# EAGLE design dualHYD-PRESS (EAGLE 7.6.0)

## Sheet 1 of 4
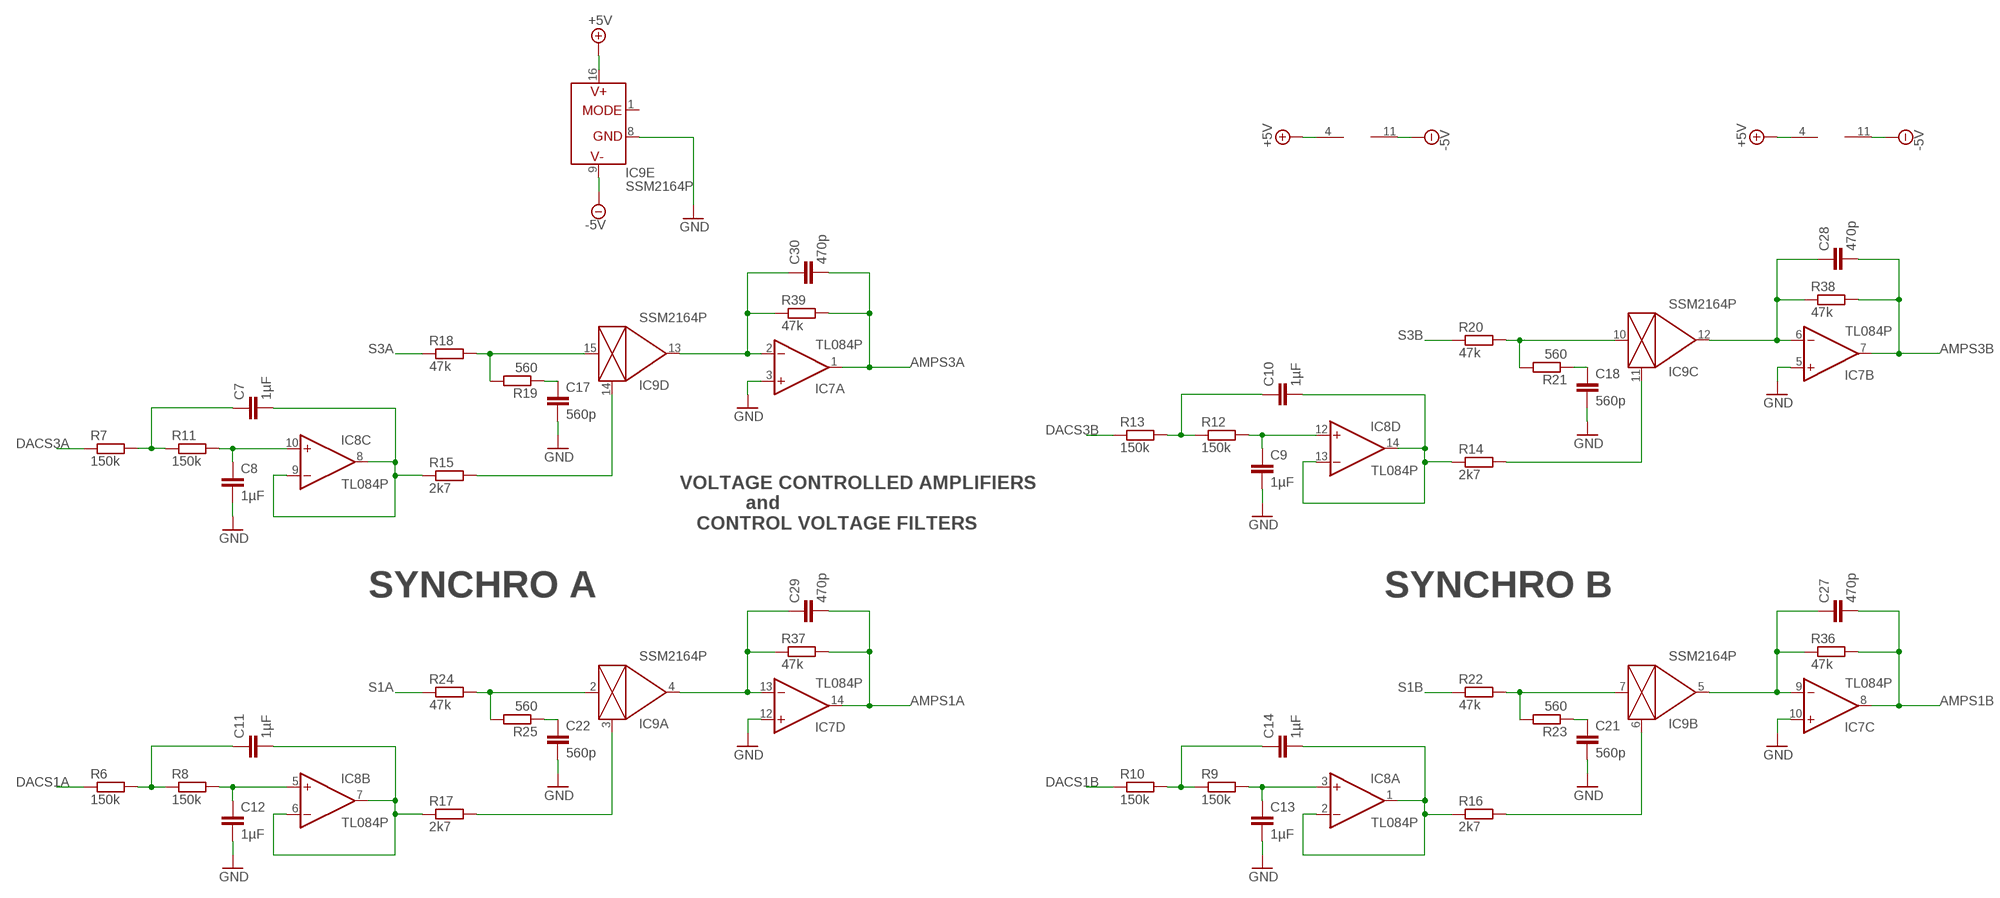
[diagram p0: schematic, sheet 1]

### Parts
C7  1µF  C-EU025-025X050  [C025-025X050]
C8  1µF  C-EU025-025X050  [C025-025X050]
C9  1µF  C-EU025-025X050  [C025-025X050]
C10  1µF  C-EU025-025X050  [C025-025X050]
C11  1µF  C-EU025-025X050  [C025-025X050]
C12  1µF  C-EU025-025X050  [C025-025X050]
C13  1µF  C-EU025-025X050  [C025-025X050]
C14  1µF  C-EU025-025X050  [C025-025X050]
C17  560p  C-EU025-025X050  [C025-025X050]
C18  560p  C-EU025-025X050  [C025-025X050]
C21  560p  C-EU025-025X050  [C025-025X050]
C22  560p  C-EU025-025X050  [C025-025X050]
C27  470p  C-EU025-025X050  [C025-025X050]
C28  470p  C-EU025-025X050  [C025-025X050]
C29  470p  C-EU025-025X050  [C025-025X050]
C30  470p  C-EU025-025X050  [C025-025X050]
IC7  TL084P  [DIL14]
IC8  TL084P  [DIL14]
IC9  SSM2164P  [DIL16]
R6  150k  R-EU_0207/7  [0207/7]
R7  150k  R-EU_0207/7  [0207/7]
R8  150k  R-EU_0207/7  [0207/7]
R9  150k  R-EU_0207/7  [0207/7]
R10  150k  R-EU_0207/7  [0207/7]
R11  150k  R-EU_0207/7  [0207/7]
R12  150k  R-EU_0207/7  [0207/7]
R13  150k  R-EU_0207/7  [0207/7]
R14  2k7  R-EU_0207/7  [0207/7]
R15  2k7  R-EU_0207/7  [0207/7]
R16  2k7  R-EU_0207/7  [0207/7]
R17  2k7  R-EU_0207/7  [0207/7]
R18  47k  R-EU_0207/7  [0207/7]
R19  560  R-EU_0207/7  [0207/7]
R20  47k  R-EU_0207/7  [0207/7]
R21  560  R-EU_0207/7  [0207/7]
R22  47k  R-EU_0207/7  [0207/7]
R23  560  R-EU_0207/7  [0207/7]
R24  47k  R-EU_0207/7  [0207/7]
R25  560  R-EU_0207/7  [0207/7]
R36  47k  R-EU_0207/7  [0207/7]
R37  47k  R-EU_0207/7  [0207/7]
R38  47k  R-EU_0207/7  [0207/7]
R39  47k  R-EU_0207/7  [0207/7]

### Nets
+5V [+5V]: IC7.4(P:V+) IC8.4(P:V+) IC9.16(E:V+) ; also sheet 2,4
-5V [-5V]: IC7.11(P:V-) IC8.11(P:V-) IC9.9(E:V-) ; also sheet 2,4
AMPS1A: C29.2 IC7.14(D:OUT) R37.2 ; also sheet 3
AMPS1B: C27.2 IC7.8(C:OUT) R36.2 ; also sheet 3
AMPS3A: C30.2 IC7.1(A:OUT) R39.2 ; also sheet 3
AMPS3B: C28.2 IC7.7(B:OUT) R38.2 ; also sheet 3
BXCF: C10.2 IC8.13(D:-IN) IC8.14(D:OUT) R14.1
BZCF: C11.2 IC8.6(B:-IN) IC8.7(B:OUT) R17.1
DACS1A: R6.1 ; also sheet 2
DACS1B: R10.1 ; also sheet 2
DACS3A: R7.1 ; also sheet 2
DACS3B: R13.1 ; also sheet 2
GND [ground]: C8.2 C9.2 C12.2 C13.2 C17.2 C18.2 C21.2 C22.2 IC7.3(A:+IN) IC7.5(B:+IN) IC7.10(C:+IN) IC7.12(D:+IN) IC9.8(E:GND) ; also sheet 2,3,4
M1XCF: C14.2 IC8.1(A:OUT) IC8.2(A:-IN) R16.1
M1YCF: C7.2 IC8.8(C:OUT) IC8.9(C:-IN) R15.1
N$3: C14.1 R9.1 R10.2
N$4: IC9.3(A:CTRL) R17.2
N$5: C13.1 IC8.3(A:+IN) R9.2
N$7: C11.1 R6.2 R8.1
N$8: IC9.14(D:CTRL) R15.2
N$9: C12.1 IC8.5(B:+IN) R8.2
N$11: C8.1 IC8.10(C:+IN) R11.2
N$13: C7.1 R7.2 R11.1
N$17: C10.1 R12.1 R13.2
N$18: C9.1 IC8.12(D:+IN) R12.2
N$28: IC9.11(C:CTRL) R14.2
N$32: IC9.6(B:CTRL) R16.2
N$49: IC9.10(C:IN) R20.2 R21.2
N$50: C18.1 R21.1
N$51: IC9.15(D:IN) R18.2 R19.2
N$52: C17.1 R19.1
N$53: IC9.7(B:IN) R22.2 R23.2
N$54: C21.1 R23.1
N$55: IC9.2(A:IN) R24.2 R25.2
N$56: C22.1 R25.1
N$57: C29.1 IC7.13(D:-IN) IC9.4(A:OUT) R37.1
N$59: C30.1 IC7.2(A:-IN) IC9.13(D:OUT) R39.1
N$62: C28.1 IC7.6(B:-IN) IC9.12(C:OUT) R38.1
N$63: C27.1 IC7.9(C:-IN) IC9.5(B:OUT) R36.1
S1A: R24.1 ; also sheet 4
S1B: R22.1 ; also sheet 4
S3A: R18.1 ; also sheet 4
S3B: R20.1 ; also sheet 4
Unconnected: IC9.1(E:MODE)

### Notes on the sheet
- VOLTAGE CONTROLLED AMPLIFIERS
              and
     CONTROL VOLTAGE FILTERS
- SYNCHRO A | SYNCHRO B

## Sheet 2 of 4
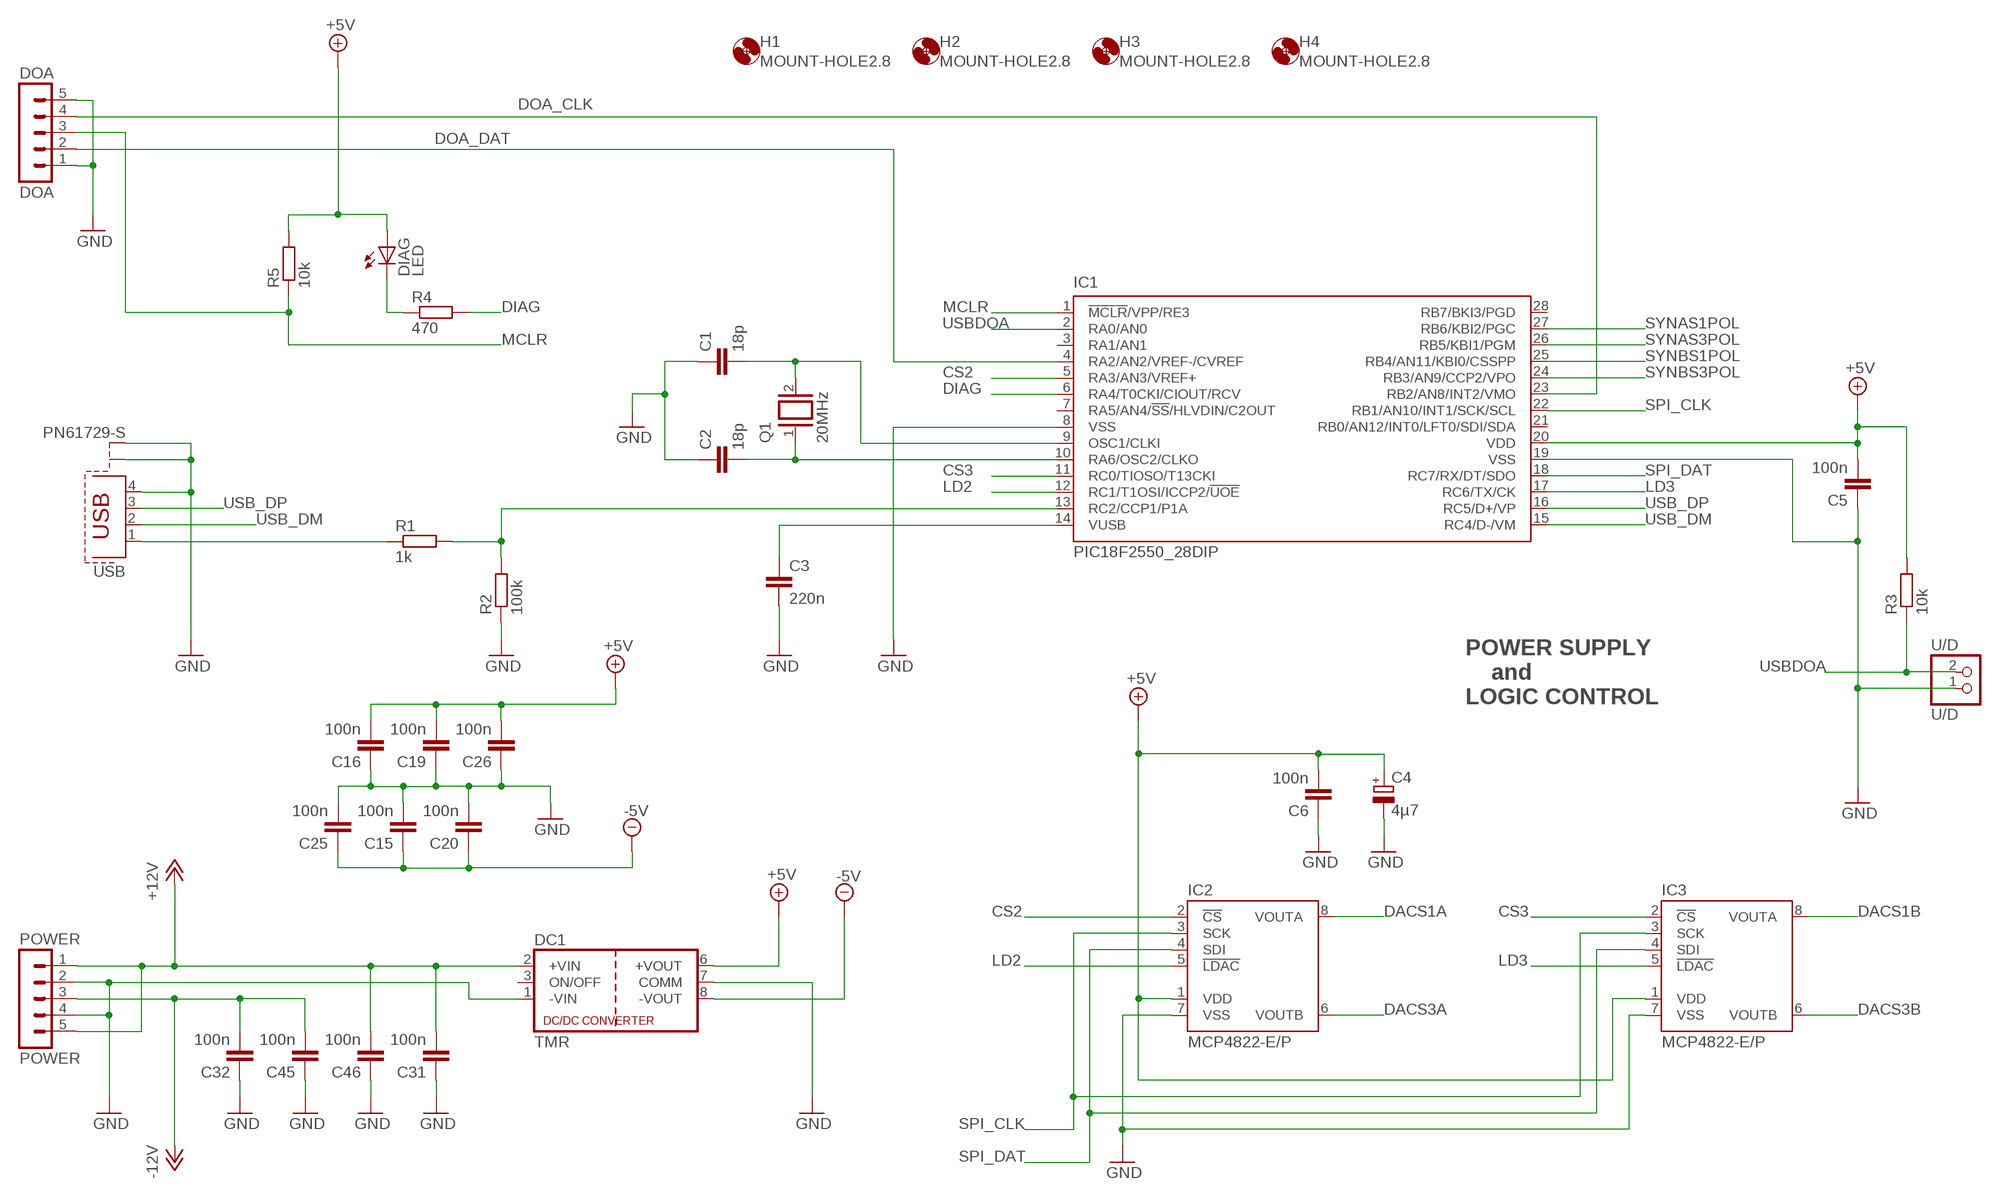
[diagram p1: schematic, sheet 2]

### Parts
C1  18p  C-EU025-025X050  [C025-025X050]
C2  18p  C-EU025-025X050  [C025-025X050]
C3  220n  C5/3  [C5B3]
C4  4µ7  CPOL-EUE2.5-5  [E2,5-5]
C5  100n  C-EU025-025X050  [C025-025X050]
C6  100n  C-EU025-025X050  [C025-025X050]
C15  100n  C-EU025-025X050  [C025-025X050]
C16  100n  C-EU025-025X050  [C025-025X050]
C19  100n  C-EU025-025X050  [C025-025X050]
C20  100n  C-EU025-025X050  [C025-025X050]
C25  100n  C-EU025-025X050  [C025-025X050]
C26  100n  C-EU025-025X050  [C025-025X050]
C31  100n  C-EU025-025X050  [C025-025X050]
C32  100n  C-EU025-025X050  [C025-025X050]
C45  100n  C-EU025-025X050  [C025-025X050]
C46  100n  C-EU025-025X050  [C025-025X050]
DC1  TMR  [TRACO_SIP-8]
DIAG  LED  LED3MM  [LED3MM]
DOA  DOA  MA05-1  [MA05-1]
H1  MOUNT-HOLE2.8  [2,8]
H2  MOUNT-HOLE2.8  [2,8]
H3  MOUNT-HOLE2.8  [2,8]
H4  MOUNT-HOLE2.8  [2,8]
IC1  PIC18F2550_28DIP  [DIL28-3]
IC2  MCP4822-E/P  [DIL08]
IC3  MCP4822-E/P  [DIL08]
POWER  POWER  MA05-1  [MA05-1]
Q1  20MHz  XTAL/S  [QS]
R1  1k  R-EU_0204/7  [0204/7]
R2  100k  R-EU_0204/7  [0204/7]
R3  10k  R-EU_0204/7  [0204/7]
R4  470  R-EU_0204/7  [0204/7]
R5  10k  R-EU_0204/7  [0204/7]
U/D  U/D  PINHD-1X2  [1X02]
USB  PN61729-S  [PN61729-S]

### Nets
+5V [+5V]: C4.+ C5.2 C6.2 C16.2 C19.2 C26.2 DC1.6(+VOUT) DIAG.A IC1.20(VDD) IC2.1(VDD) IC3.1(VDD) R3.2 R5.2 ; also sheet 1,4
+12V [+12V]: C31.2 C46.2 DC1.2(+VIN) POWER.1 POWER.5 ; also sheet 3
-5V [-5V]: C15.1 C20.1 C25.1 DC1.8(-VOUT) ; also sheet 1,4
-12V [-12V]: C32.2 C45.2 POWER.3 ; also sheet 3
CS2: IC1.5(RA3/AN3/VREF+) IC2.2(!CS)
CS3: IC1.11(RC0/TIOSO/T13CKI) IC3.2(!CS)
DACS1A: IC2.8(VOUTA) ; also sheet 1
DACS1B: IC3.8(VOUTA) ; also sheet 1
DACS3A: IC2.6(VOUTB) ; also sheet 1
DACS3B: IC3.6(VOUTB) ; also sheet 1
DIAG: IC1.6(RA4/T0CKI/CIOUT/RCV) R4.2
DOA_CLK: DOA.4 IC1.23(RB2/AN8/INT2/VMO)
DOA_DAT: DOA.2 IC1.4(RA2/AN2/VREF-/CVREF)
GND [ground]: C1.1 C2.1 C3.2 C4.- C5.1 C6.1 C15.2 C16.1 C19.1 C20.2 C25.2 C26.1 C31.1 C32.1 C45.1 C46.1 DC1.1(-VIN) DC1.7(COMM) DOA.1 DOA.5 IC1.8(VSS) IC1.19(VSS) IC2.7(VSS) IC3.7(VSS) POWER.2 POWER.4 R2.1 U/D.1 USB.4 USB.S1 USB.S2 ; also sheet 1,3,4
LD2: IC1.12(RC1/T1OSI/ICCP2/!UOE) IC2.5(!LDAC)
LD3: IC1.17(RC6/TX/CK) IC3.5(!LDAC)
MCLR: DOA.3 IC1.1(!MCLR!/VPP/RE3) R5.1
N$58: R1.1 USB.1
N$60: IC1.13(RC2/CCP1/P1A) R1.2 R2.2
N$61: C2.2 IC1.10(RA6/OSC2/CLKO) Q1.1
N$84: C1.2 IC1.9(OSC1/CLKI) Q1.2
N$88: DIAG.K(C) R4.1
N$96: C3.1 IC1.14(VUSB)
SPI_CLK: IC1.22(RB1/AN10/INT1/SCK/SCL) IC2.3(SCK) IC3.3(SCK)
SPI_DAT: IC1.18(RC7/RX/DT/SDO) IC2.4(SDI) IC3.4(SDI)
SYNAS1POL: IC1.27(RB6/KBI2/PGC) ; also sheet 4
SYNAS3POL: IC1.26(RB5/KBI1/PGM) ; also sheet 4
SYNBS1POL: IC1.25(RB4/AN11/KBI0/CSSPP) ; also sheet 4
SYNBS3POL: IC1.24(RB3/AN9/CCP2/VPO) ; also sheet 4
USB_DM: IC1.15(RC4/D-/VM) USB.2
USB_DP: IC1.16(RC5/D+/VP) USB.3
USBDOA: IC1.2(RA0/AN0) R3.1 U/D.2
Unconnected: DC1.3(ON/OFF) IC1.3(RA1/AN1) IC1.7(RA5/AN4/!SS!/HLVDIN/C2OUT) IC1.21(RB0/AN12/INT0/LFT0/SDI/SDA) IC1.28(RB7/BKI3/PGD)

### Notes on the sheet
- POWER SUPPLY
      and
  LOGIC CONTROL

## Sheet 3 of 4
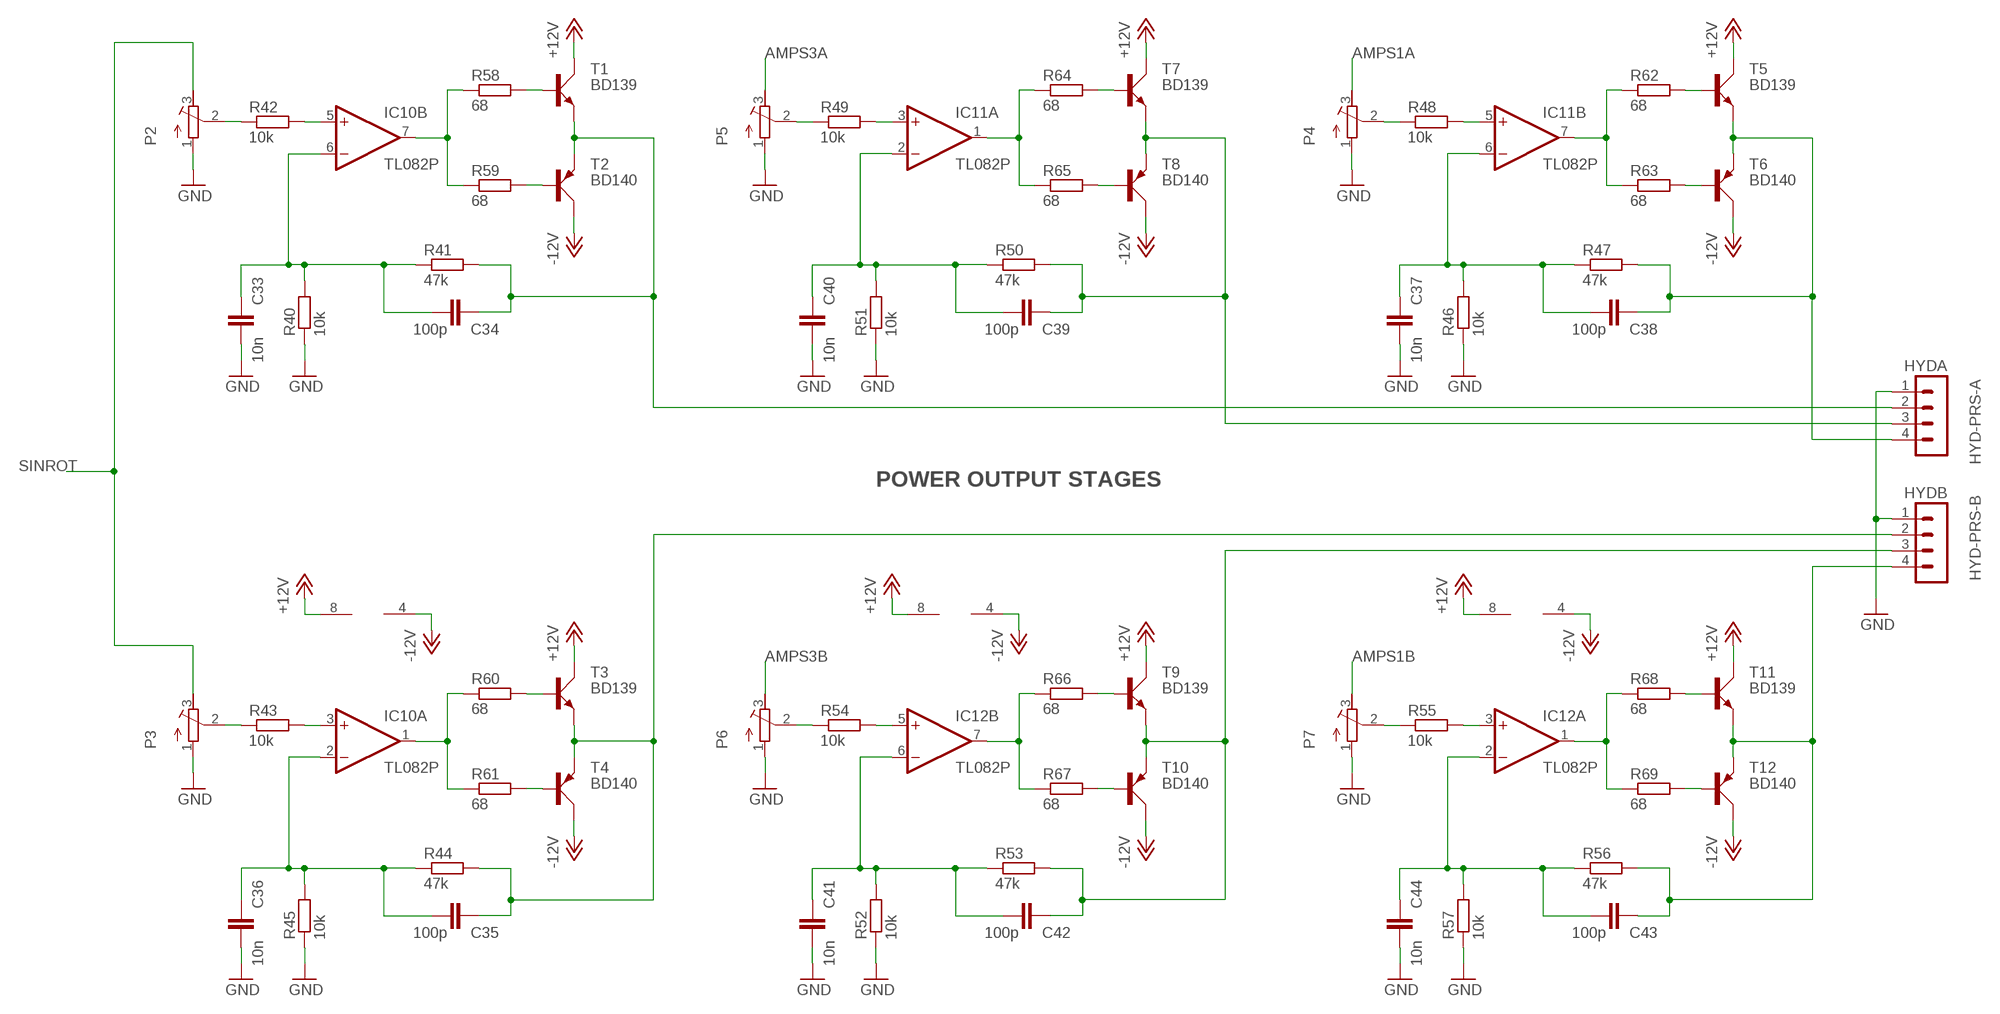
[diagram p2: schematic, sheet 3]

### Parts
C33  10n  C-EU025-025X050  [C025-025X050]
C34  100p  C-EU025-025X050  [C025-025X050]
C35  100p  C-EU025-025X050  [C025-025X050]
C36  10n  C-EU025-025X050  [C025-025X050]
C37  10n  C-EU025-025X050  [C025-025X050]
C38  100p  C-EU025-025X050  [C025-025X050]
C39  100p  C-EU025-025X050  [C025-025X050]
C40  10n  C-EU025-025X050  [C025-025X050]
C41  10n  C-EU025-025X050  [C025-025X050]
C42  100p  C-EU025-025X050  [C025-025X050]
C43  100p  C-EU025-025X050  [C025-025X050]
C44  10n  C-EU025-025X050  [C025-025X050]
HYD-PRS-A  HYDA  MA04-1  [MA04-1]
HYD-PRS-B  HYDB  MA04-1  [MA04-1]
IC10  TL082P  [DIL08]
IC11  TL082P  [DIL08]
IC12  TL082P  [DIL08]
P2  R-TRIMM64Y  [RTRIM64Y]
P3  R-TRIMM64Y  [RTRIM64Y]
P4  R-TRIMM64Y  [RTRIM64Y]
P5  R-TRIMM64Y  [RTRIM64Y]
P6  R-TRIMM64Y  [RTRIM64Y]
P7  R-TRIMM64Y  [RTRIM64Y]
R40  10k  R-EU_0204/7  [0204/7]
R41  47k  R-EU_0204/7  [0204/7]
R42  10k  R-EU_0204/7  [0204/7]
R43  10k  R-EU_0204/7  [0204/7]
R44  47k  R-EU_0204/7  [0204/7]
R45  10k  R-EU_0204/7  [0204/7]
R46  10k  R-EU_0204/7  [0204/7]
R47  47k  R-EU_0204/7  [0204/7]
R48  10k  R-EU_0204/7  [0204/7]
R49  10k  R-EU_0204/7  [0204/7]
R50  47k  R-EU_0204/7  [0204/7]
R51  10k  R-EU_0204/7  [0204/7]
R52  10k  R-EU_0204/7  [0204/7]
R53  47k  R-EU_0204/7  [0204/7]
R54  10k  R-EU_0204/7  [0204/7]
R55  10k  R-EU_0204/7  [0204/7]
R56  47k  R-EU_0204/7  [0204/7]
R57  10k  R-EU_0204/7  [0204/7]
R58  68  R-EU_0204/7  [0204/7]
R59  68  R-EU_0204/7  [0204/7]
R60  68  R-EU_0204/7  [0204/7]
R61  68  R-EU_0204/7  [0204/7]
R62  68  R-EU_0204/7  [0204/7]
R63  68  R-EU_0204/7  [0204/7]
R64  68  R-EU_0204/7  [0204/7]
R65  68  R-EU_0204/7  [0204/7]
R66  68  R-EU_0204/7  [0204/7]
R67  68  R-EU_0204/7  [0204/7]
R68  68  R-EU_0204/7  [0204/7]
R69  68  R-EU_0204/7  [0204/7]
T1  BD139  [TO126AV]
T2  BD140  [TO126AV]
T3  BD139  [TO126AV]
T4  BD140  [TO126AV]
T5  BD139  [TO126AV]
T6  BD140  [TO126AV]
T7  BD139  [TO126AV]
T8  BD140  [TO126AV]
T9  BD139  [TO126AV]
T10  BD140  [TO126AV]
T11  BD139  [TO126AV]
T12  BD140  [TO126AV]

### Nets
+12V [+12V]: IC10.8(P:V+) IC11.8(P:V+) IC12.8(P:V+) T1.C T3.C T5.C T7.C T9.C T11.C ; also sheet 2
-12V [-12V]: IC10.4(P:V-) IC11.4(P:V-) IC12.4(P:V-) T2.C T4.C T6.C T8.C T10.C T12.C ; also sheet 2
AMPS1A: P4.3(E) ; also sheet 1
AMPS1B: P7.3(E) ; also sheet 1
AMPS3A: P5.3(E) ; also sheet 1
AMPS3B: P6.3(E) ; also sheet 1
GND [ground]: C33.1 C36.1 C37.1 C40.1 C41.1 C44.1 HYD-PRS-A.1 HYD-PRS-B.1 P2.1(A) P3.1(A) P4.1(A) P5.1(A) P6.1(A) P7.1(A) R40.1 R45.1 R46.1 R51.1 R52.1 R57.1 ; also sheet 1,2,4
N$12: R58.2 T1.B
N$16: P2.2(S) R42.1
N$20: R59.2 T2.B
N$23: IC10.5(B:+IN) R42.2
N$24: R60.2 T3.B
N$25: R61.2 T4.B
N$26: P6.2(S) R54.1
N$27: R62.2 T5.B
N$29: R63.2 T6.B
N$30 [SYN]: C38.2 HYD-PRS-A.4 R47.2 T5.E T6.E
N$31 [SYN]: C42.2 HYD-PRS-B.3 R53.2 T9.E T10.E
N$33: R67.2 T10.B
N$34: R66.2 T9.B
N$36: R64.2 T7.B
N$37: R65.2 T8.B
N$38 [SYN]: C35.2 HYD-PRS-B.2 R44.2 T3.E T4.E
N$39: R68.2 T11.B
N$40: R69.2 T12.B
N$41: IC10.3(A:+IN) R43.2
N$42 [SYN]: C43.2 HYD-PRS-B.4 R56.2 T11.E T12.E
N$43: IC12.7(B:OUT) R66.1 R67.1
N$44: IC12.1(A:OUT) R68.1 R69.1
N$45: IC11.7(B:OUT) R62.1 R63.1
N$46: P3.2(S) R43.1
N$47: IC11.1(A:OUT) R64.1 R65.1
N$48: IC10.7(B:OUT) R58.1 R59.1
N$64: P5.2(S) R49.1
N$65: IC11.3(A:+IN) R49.2
N$66: P4.2(S) R48.1
N$67: IC11.5(B:+IN) R48.2
N$68: IC10.1(A:OUT) R60.1 R61.1
N$69: IC12.5(B:+IN) R54.2
N$70: C33.2 C34.1 IC10.6(B:-IN) R40.2 R41.1
N$71: P7.2(S) R55.1
N$72: C35.1 C36.2 IC10.2(A:-IN) R44.1 R45.2
N$73: C37.2 C38.1 IC11.6(B:-IN) R46.2 R47.1
N$74: IC12.3(A:+IN) R55.2
N$75: C39.1 C40.2 IC11.2(A:-IN) R50.1 R51.2
N$77: C41.2 C42.1 IC12.6(B:-IN) R52.2 R53.1
N$79: C43.1 C44.2 IC12.2(A:-IN) R56.1 R57.2
N$99 [SYN]: C39.2 HYD-PRS-A.3 R50.2 T7.E T8.E
N$106 [SYN]: C34.2 HYD-PRS-A.2 R41.2 T1.E T2.E
SINROT: P2.3(E) P3.3(E) ; also sheet 4

### Notes on the sheet
- POWER OUTPUT STAGES

## Sheet 4 of 4
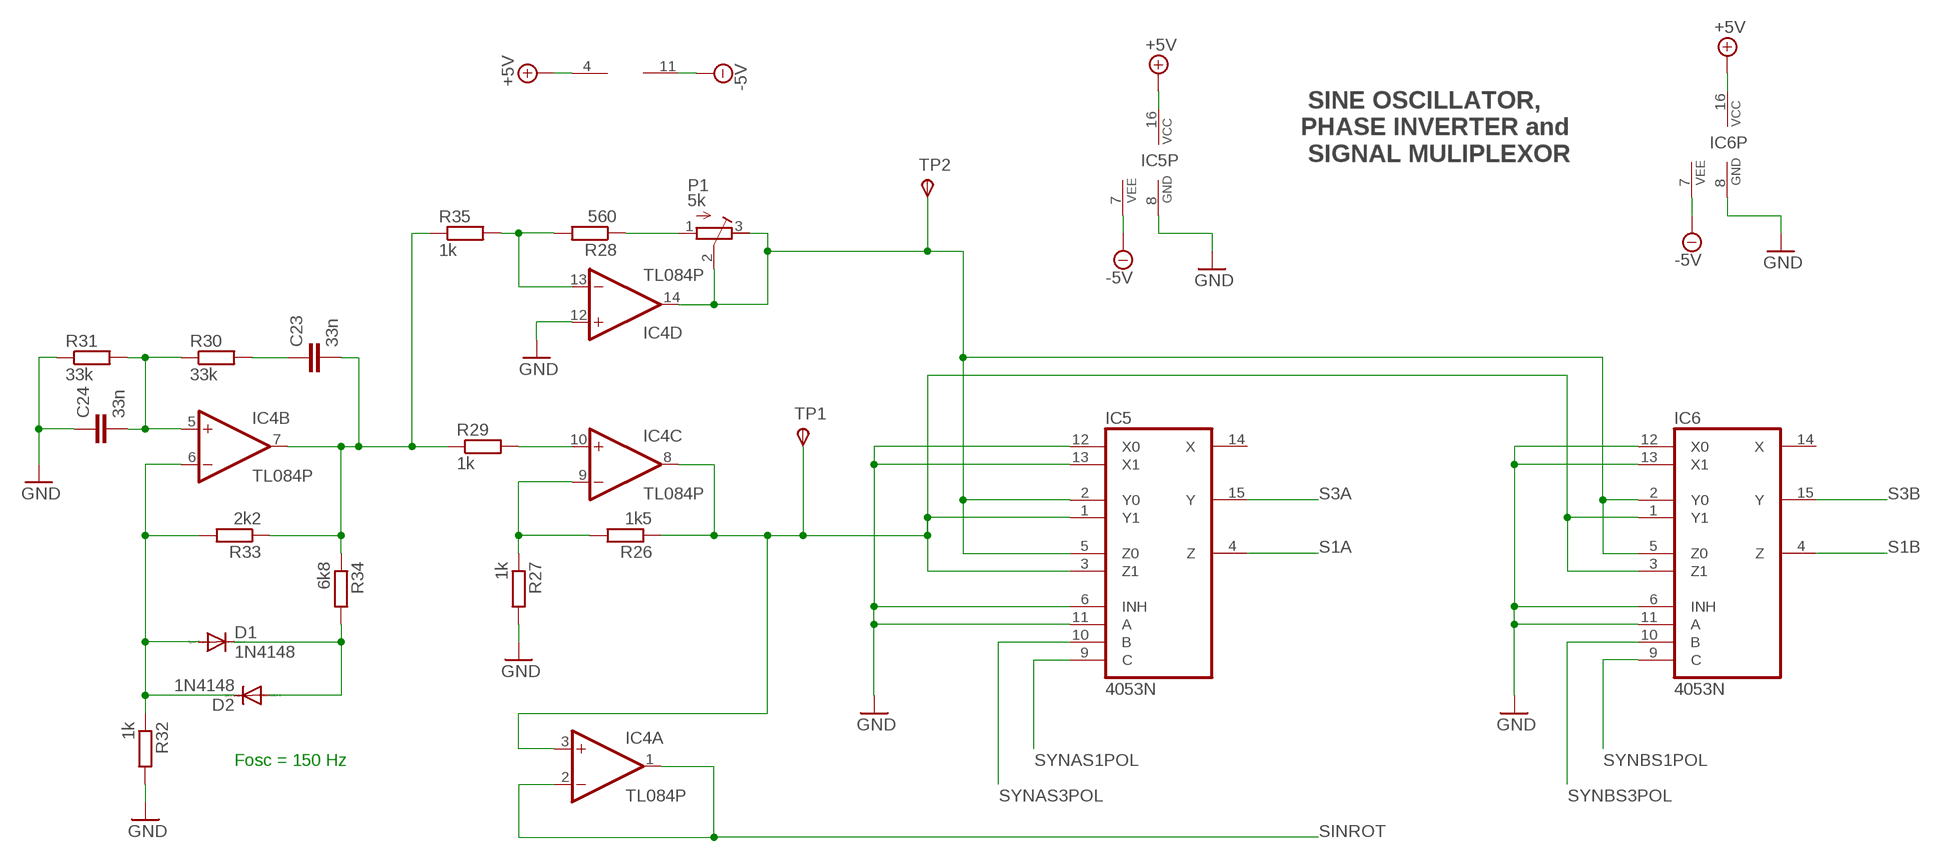
[diagram p3: schematic, sheet 4]

### Parts
C23  33n  C-EU025-024X044  [C025-024X044]
C24  33n  C-EU025-024X044  [C025-024X044]
D1  1N4148  1N4148DO35-7  [DO35-7]
D2  1N4148  1N4148DO35-7  [DO35-7]
IC4  TL084P  [DIL14]
IC5  4053N  [DIL16]
IC6  4053N  [DIL16]
P1  5k  R-TRIMM64Y  [RTRIM64Y]
R26  1k5  R-EU_0204/7  [0204/7]
R27  1k  R-EU_0204/7  [0204/7]
R28  560  R-EU_0204/7  [0204/7]
R29  1k  R-EU_0204/7  [0204/7]
R30  33k  R-EU_0204/7  [0204/7]
R31  33k  R-EU_0204/7  [0204/7]
R32  1k  R-EU_0204/7  [0204/7]
R33  2k2  R-EU_0204/7  [0204/7]
R34  6k8  R-EU_0204/7  [0204/7]
R35  1k  R-EU_0204/7  [0204/7]
TP1  TPSPAD1-17  [P1-17]
TP2  TPSPAD1-17  [P1-17]

### Nets
+5V [+5V]: IC4.4(P:V+) IC5.16(VCC) IC6.16(VCC) ; also sheet 1,2
-5V [-5V]: IC4.11(P:V-) IC5.7(VEE) IC6.7(VEE) ; also sheet 1,2
GND [ground]: C24.1 IC4.12(D:+IN) IC5.6(INH) IC5.8(GND) IC5.11(A) IC5.12(X0) IC5.13(X1) IC6.6(INH) IC6.8(GND) IC6.11(A) IC6.12(X0) IC6.13(X1) R27.2 R31.1 R32.2 ; also sheet 1,2,3
N$1: D1.A D2.C IC4.6(B:-IN) R32.1 R33.2
N$2: D1.C D2.A R34.2
N$6: IC4.9(C:-IN) R26.2 R27.1
N$10: IC4.13(D:-IN) R28.2 R35.2
N$14: IC4.10(C:+IN) R29.2
N$15: IC4.3(A:+IN) IC4.8(C:OUT) IC5.1(Y1) IC5.3(Z1) IC6.1(Y1) IC6.3(Z1) R26.1 TP1.TP(PP)
N$19: C23.2 IC4.7(B:OUT) R29.1 R33.1 R34.1 R35.1
N$21: P1.1(A) R28.1
N$22: C23.1 R30.2
N$35: IC4.14(D:OUT) IC5.2(Y0) IC5.5(Z0) IC6.2(Y0) IC6.5(Z0) P1.2(S) P1.3(E) TP2.TP(PP)
N$85: C24.2 IC4.5(B:+IN) R30.1 R31.2
S1A: IC5.4(Z) ; also sheet 1
S1B: IC6.4(Z) ; also sheet 1
S3A: IC5.15(Y) ; also sheet 1
S3B: IC6.15(Y) ; also sheet 1
SINROT: IC4.1(A:OUT) IC4.2(A:-IN) ; also sheet 3
SYNAS1POL: IC5.9(C) ; also sheet 2
SYNAS3POL: IC5.10(B) ; also sheet 2
SYNBS1POL: IC6.9(C) ; also sheet 2
SYNBS3POL: IC6.10(B) ; also sheet 2
Unconnected: IC5.14(X) IC6.14(X)

### Notes on the sheet
- SINE OSCILLATOR,
  PHASE INVERTER and
   SIGNAL MULIPLEXOR
- Fosc = 150 Hz

## Library data of the parts
C1 C2 C5-C46 = rcl:C-EU: CAPACITOR, European symbol
C3 = capacitor-wima:C: CAPACITOR naming: grid - package width
C4 = rcl:CPOL-EU: POLARIZED CAPACITOR, European symbol
D1 D2 = diode:1N4148: DIODE high speed (Philips)
DC1 = traco-tmr-dual:TMR
DIAG = henk:LED: LEDs Standard schematic elements and footprints for 5mm, 3mm, 1206, and 0603 sized LEDs. 5mm - Spark Fun Electronics SKU : COM-00529 (and others)
DOA POWER = con-lstb:MA05-1: PIN HEADER; OC_FARNELL: unknown; OC_NEWARK: unknown
H1-H4 = holes:MOUNT-HOLE: MOUNTING HOLE with drill center marker
HYD-PRS-A HYD-PRS-B = con-lstb:MA04-1: PIN HEADER; OC_FARNELL: unknown; OC_NEWARK: unknown
IC1 = microchip:PIC18F2*_28: USB Microcontrollers with nanoWatt Technology High-Performance, Enhanced Flash, 28/40/44-Pin, Source: http://ww1.microchip.com/downloads/en/devicedoc/39632c.pdf; MF: MICROCHIP; MPN: PIC18F2550-I/SP; OC_FARNELL: 1523822; OC_NEWARK: 80K6054
IC2 IC3 = nh-ic:MCP4822: Microchip MCP4822 According to datasheet http://ww1.microchip.com/downloads/en/DeviceDoc/22249A.pdf. Created by Nils Hintze <n.hintze@elektronikpage.net>
IC4 IC7 IC8 = linear:TL084: OP AMP
IC5 IC6 = 40xx:4053: Triple 2-channel ANALOG MULTIPLEXER
IC9 = ssm2164:SSM2164
IC10-IC12 = linear:TL082: OP AMP Data sheet <http://www.ti.com/lit/ds/symlink/tl084a . pdf>; DATA_SHEET: <a href="http://www.ti.com/lit/ds/symlink/tl084a.pdf"> Data sheet </a>
P1-P7 = rcl:R-TRIMM: Trimm resistor
Q1 = special:XTAL/S: CRYSTAL
R1-R69 = rcl:R-EU_: RESISTOR, European symbol
T1 T3 T5 T7 T9 T11 = transistor-power:BD139: NPN TRANSISTOR
T2 T4 T6 T8 T10 T12 = transistor-power:BD140: PNP TRANSISTOR
TP1 TP2 = testpad:TPS: TEST PIN
U/D = pinhead:PINHD-1X2: PIN HEADER
USB = con-berg:PN61729-S: BERG USB connector; OC_FARNELL: unknown; OC_NEWARK: unknown

## Net classes
0 default: width 0.254 mm, drill 0.254 mm, clearance 0.254 mm
1 ground: width 0.508 mm, drill 0.254 mm, clearance 0.254 mm
2 +5V: width 0.381 mm, drill 0.254 mm, clearance 0.254 mm
3 -5V: width 0.381 mm, drill 0.254 mm, clearance 0.254 mm
4 +12V: width 0.381 mm, drill 0.254 mm, clearance 0.254 mm
5 -12V: width 0.381 mm, drill 0.254 mm, clearance 0.254 mm
6 SYN: width 0.381 mm, drill 0.381 mm, clearance 0.508 mm
7 HIV2: width 0.381 mm, drill 0.381 mm, clearance 0.508 mm

## Board
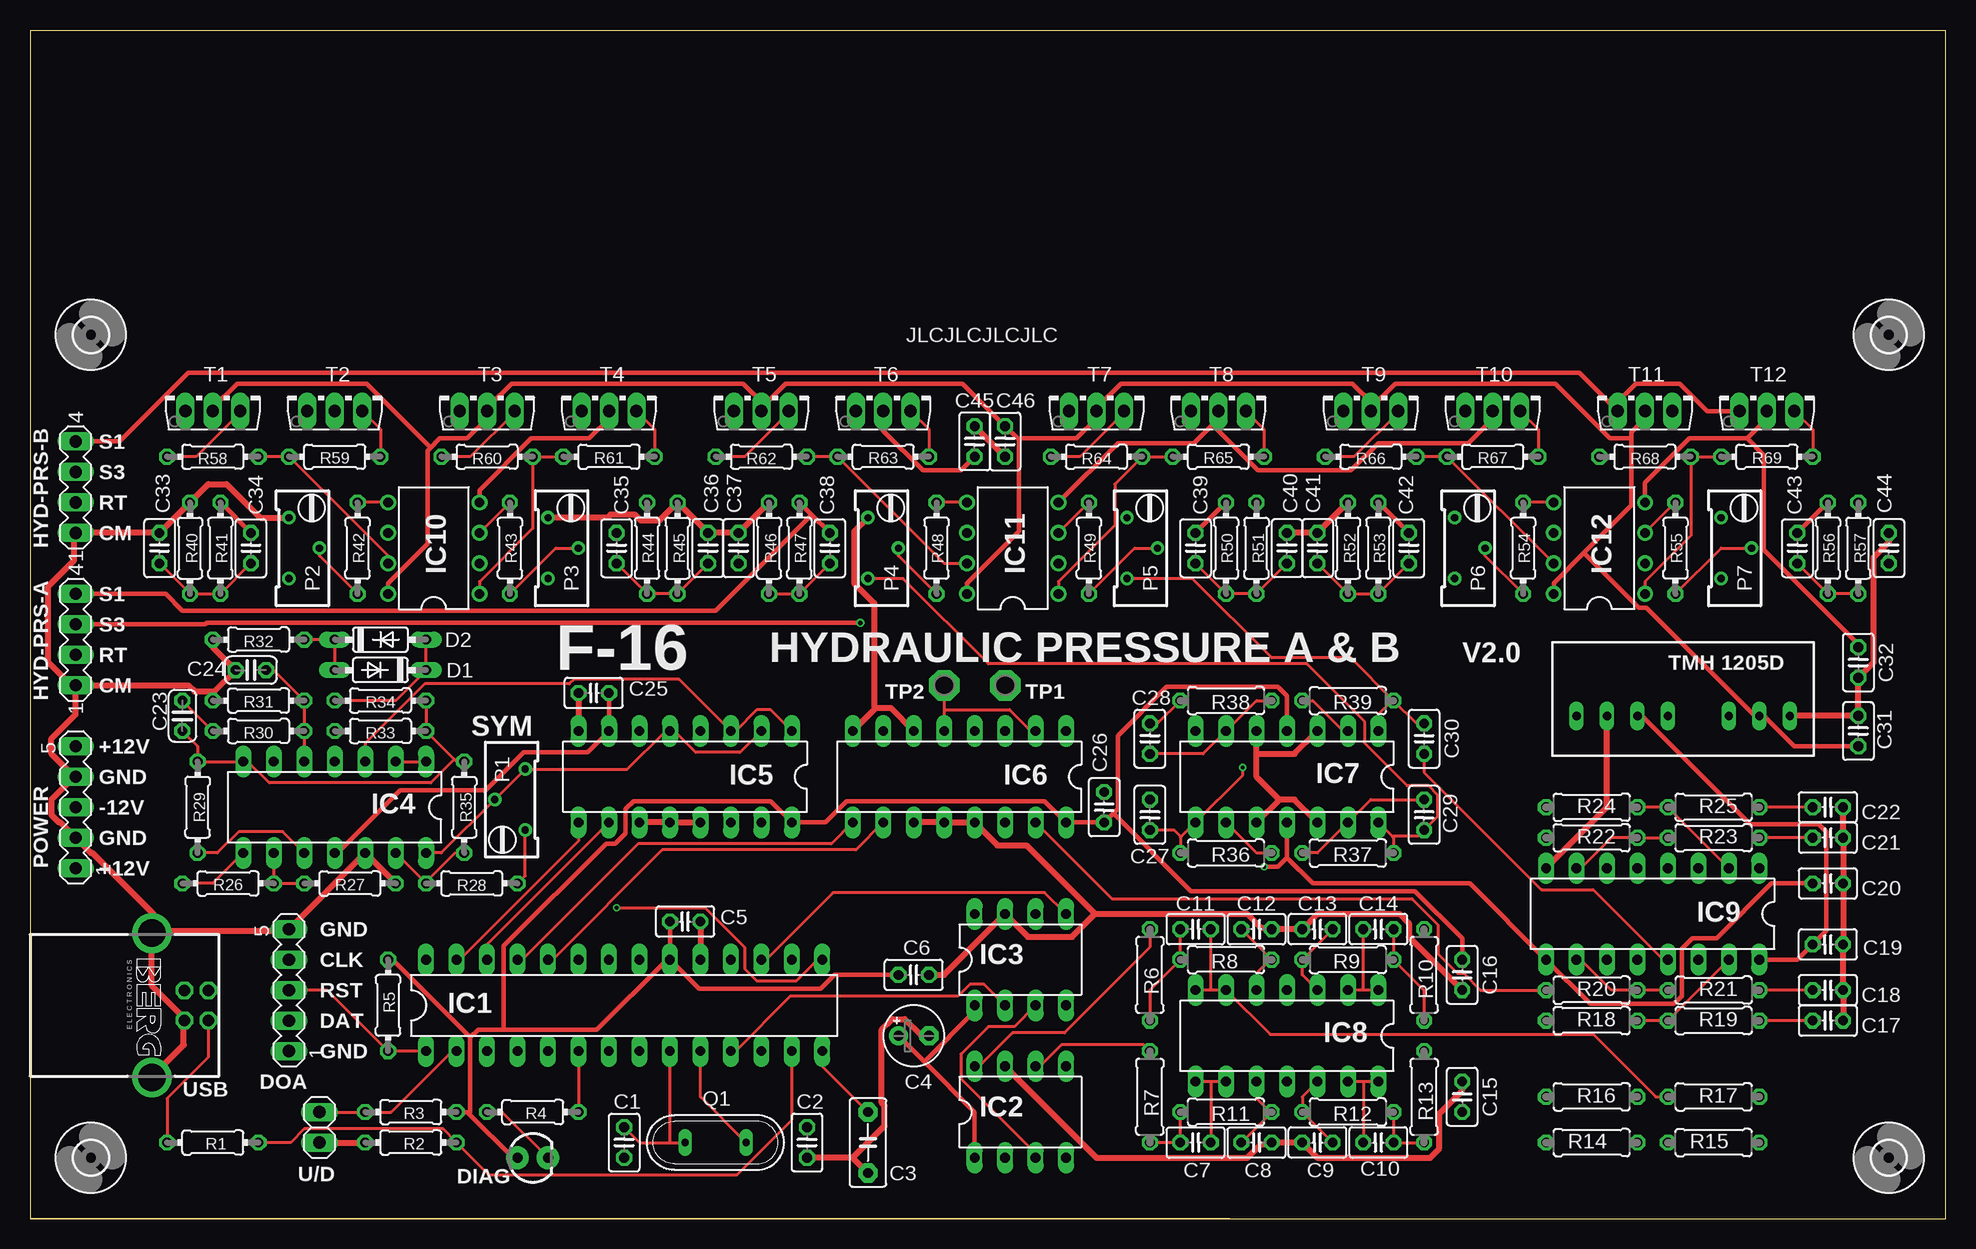
[diagram p4: board, top side]
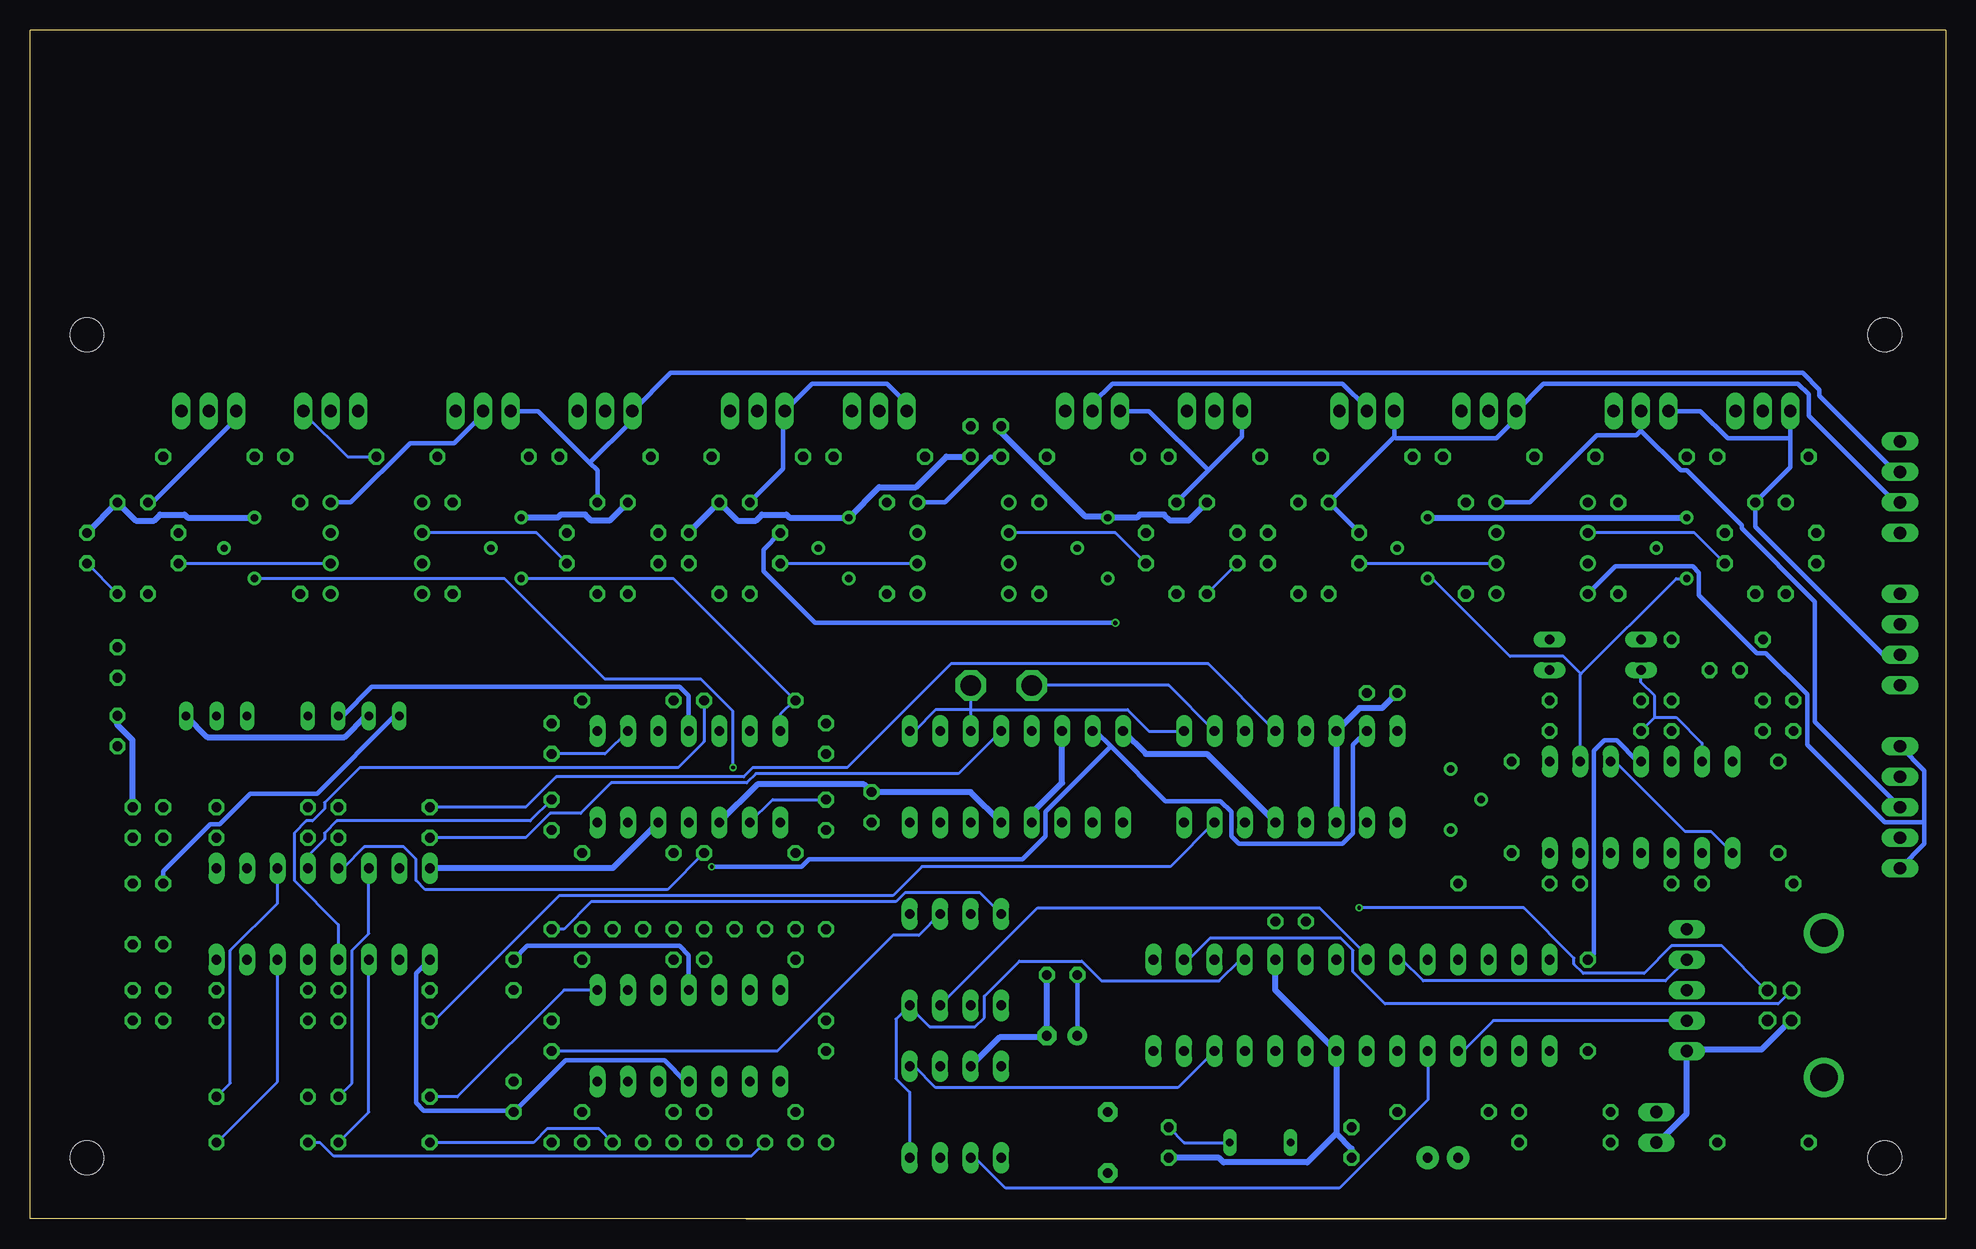
[diagram p5: board, bottom side, seen from below]

Size 159.69 x 99.07 mm. Coordinates in mm from the lower left corner, seen from the top.
Outline: 159.69,99.06 159.69,0.01 0,0.01 0,99.06
Outline: 100,0 0,0
Outline: 0,99.07 159.69,99.07
Copper layers (1*16): Top 0.035mm / dielectric 1.5mm / Bottom 0.035mm
Design rules "ITEADstudio_DRC": minimum track width 6mil, minimum drill 12mil, track to track 6mil, track to pad 6mil, pad to pad 6mil, via to via 6mil, smd to smd 0mil, copper to edge 10mil, drill to drill 10mil, minimum pad ring 10mil, minimum via ring 6mil, stop-mask expansion 2mil, vias tented up to drill 100mil, thermal gap 10mil

### Footprints (pad centres in the part's own frame; a part is rotated, then mirrored left to right if it is on the bottom)
C025-025X050 = drill 0.813 octagon: 1 -1.27,0; 2 1.27,0
C5B3 = drill 0.813 pad 1.6 octagon: 1 -2.54,0; 2 2.54,0
E2,5-5 = drill 0.813 pad 1.6: + -1.27,0 | drill 0.813 pad 1.6 octagon: - 1.27,0
C025-024X044 = drill 0.813 octagon: 1 -1.27,0; 2 1.27,0
DO35-7 = drill 0.813 long: A 3.81,0; C -3.81,0
TRACO_SIP-8 = drill 0.7 long: 1 -8.89,0; 2 -6.35,0; 3 -3.81,0; 5 1.27,0; 6 3.81,0; 7 6.35,0; 8 8.89,0
LED3MM = drill 0.813 pad 1.88: A -1.27,0; K 1.27,0
MA05-1 = drill 1.016 long: 1 -5.08,0; 2 -2.54,0; 3 0,0; 4 2.54,0; 5 5.08,0
2,8 = hole 2.8: 0,0
MA04-1 = drill 1.016 long: 1 -3.81,0; 2 -1.27,0; 3 1.27,0; 4 3.81,0
DIL28-3 = drill 0.813 long: 1 -16.51,-3.81; 2 -13.97,-3.81; 3 -11.43,-3.81; 4 -8.89,-3.81; 5 -6.35,-3.81; 6 -3.81,-3.81; 7 -1.27,-3.81; 8 1.27,-3.81; 9 3.81,-3.81; 10 6.35,-3.81; 11 8.89,-3.81; 12 11.43,-3.81; 13 13.97,-3.81; 14 16.51,-3.81; 15 16.51,3.81; 16 13.97,3.81; 17 11.43,3.81; 18 8.89,3.81; 19 6.35,3.81; 20 3.81,3.81; 21 1.27,3.81; 22 -1.27,3.81; 23 -3.81,3.81; 24 -6.35,3.81; 25 -8.89,3.81; 26 -11.43,3.81; 27 -13.97,3.81; 28 -16.51,3.81
DIL08 = drill 0.813 long: 1 -3.81,-3.81; 2 -1.27,-3.81; 3 1.27,-3.81; 4 3.81,-3.81; 5 3.81,3.81; 6 1.27,3.81; 7 -1.27,3.81; 8 -3.81,3.81
DIL14 = drill 0.813 long: 1 -7.62,-3.81; 2 -5.08,-3.81; 3 -2.54,-3.81; 4 0,-3.81; 5 2.54,-3.81; 6 5.08,-3.81; 7 7.62,-3.81; 8 7.62,3.81; 9 5.08,3.81; 10 2.54,3.81; 11 0,3.81; 12 -2.54,3.81; 13 -5.08,3.81; 14 -7.62,3.81
DIL16 = drill 0.813 long: 1 -8.89,-3.81; 2 -6.35,-3.81; 3 -3.81,-3.81; 4 -1.27,-3.81; 5 1.27,-3.81; 6 3.81,-3.81; 7 6.35,-3.81; 8 8.89,-3.81; 9 8.89,3.81; 10 6.35,3.81; 11 3.81,3.81; 12 1.27,3.81; 13 -1.27,3.81; 14 -3.81,3.81; 15 -6.35,3.81; 16 -8.89,3.81
DIL08' = drill 0.813 pad 1.27: 1 -3.81,-3.81; 2 -1.27,-3.81; 3 1.27,-3.81; 4 3.81,-3.81; 5 3.81,3.81; 6 1.27,3.81; 7 -1.27,3.81; 8 -3.81,3.81
RTRIM64Y = drill 0.61: 1 0,-2.54; 2 -2.54,0; 3 0,2.54
QS = drill 0.61 long: 1 -2.54,0; 2 2.54,0
0204/7 = drill 0.813 octagon: 1 -3.81,0; 2 3.81,0
0207/7 = drill 0.813 octagon: 1 -3.81,0; 2 3.81,0
TO126AV = drill 1.016 long: B 2.286,-1.27; C 0,-1.27; E -2.286,-1.27
P1-17 = drill 1.702 pad 2.54 octagon: TP 0,0
1X02 = drill 1.016 long: 1 -1.27,0; 2 1.27,0
PN61729-S = drill 0.95 octagon: 1 1.25,4.71; 2 -1.25,4.71; 3 -1.25,2.71; 4 1.25,2.71 | drill 2.3 pad 2.9: S1 -6.02,0; S2 6.02,0

### Placement (x,y rotation side)
C1  49.53,6.36 90 top
C2  64.77,6.36 90 top
C3  69.85,6.36 270 top
C4  73.66,15.25 0 top
C5  54.61,24.78 180 top
C6  73.66,20.33 180 top
C7  97.16,6.36 0 top
C8  102.23,6.36 0 top
C9  107.31,6.36 180 top
C10  112.39,6.36 180 top
C11  97.16,24.14 0 top
C12  102.23,24.14 0 top
C13  107.31,24.14 180 top
C14  112.39,24.14 180 top
C15  119.38,10.17 90 top
C16  119.38,20.33 90 top
C17  149.86,16.52 0 top
C18  149.86,19.06 0 top
C19  149.86,22.87 180 top
C20  149.86,27.95 0 top
C21  149.86,31.76 0 top
C22  149.86,34.3 0 top
C23  12.7,41.92 270 top
C24  18.41,45.73 0 top
C25  46.99,43.82 180 top
C26  89.53,34.3 270 top
C27  93.34,33.66 270 top
C28  93.34,40.02 90 top
C29  116.2,33.66 270 top
C30  116.2,40.02 90 top
C31  152.4,40.65 270 top
C32  152.4,46.36 90 top
C33  10.79,55.89 270 top
C34  18.41,55.89 90 top
C35  48.9,55.89 90 top
C36  56.52,55.89 270 top
C37  59.05,55.89 270 top
C38  66.67,55.89 90 top
C39  97.16,55.89 90 top
C40  104.78,55.89 270 top
C41  107.31,55.89 270 top
C42  114.94,55.89 90 top
C43  147.32,55.89 90 top
C44  154.94,55.89 270 top
C45  78.74,64.78 270 top
C46  81.28,64.78 90 top
D1  29.21,45.73 180 top
D2  29.21,48.27 0 top
DC1  137.79,41.92 180 top
DIAG  41.91,5.09 0 top
DOA  21.59,19.06 90 top
H1  154.94,5.09 0 top
H2  5.08,5.09 0 top
H3  154.94,73.67 0 top
H4  5.08,73.67 0 top
HYD-PRS-A  3.81,48.27 90 top
HYD-PRS-B  3.81,60.97 90 top
IC1  49.53,17.79 0 top
IC2  82.55,8.9 0 top
IC3  82.55,21.6 0 top
IC4  25.4,34.3 180 top
IC5  54.61,36.84 180 top
IC6  77.47,36.84 180 top
IC7  104.78,36.84 180 top
IC8  104.78,15.25 180 top
IC9  135.25,25.41 180 top
IC10  TL082P  [DIL08']  33.66,55.89 90 top
IC11  TL082P  [DIL08']  81.92,55.89 90 top
IC12  TL082P  [DIL08']  130.81,55.89 90 top
P1  41.27,34.93 0 top
P2  21.59,55.89 180 top
P3  43.18,55.89 180 top
P4  69.85,55.89 180 top
P5  91.44,55.89 180 top
P6  118.75,55.89 180 top
P7  140.97,55.89 180 top
POWER  3.81,34.3 90 top
Q1  57.15,6.36 180 top
R1  15.24,6.36 0 top
R2  31.75,6.36 0 top
R3  31.75,8.9 0 top
R4  41.91,8.9 0 top
R5  29.84,17.79 90 top
R6  93.34,20.33 270 top
R7  93.34,10.17 270 top
R8  99.69,21.6 0 top
R9  109.86,21.6 180 top
R10  116.2,20.33 270 top
R11  99.69,8.9 0 top
R12  109.86,8.9 180 top
R13  116.2,10.17 270 top
R14  130.18,6.36 0 top
R15  140.34,6.36 0 top
R16  130.18,10.17 0 top
R17  140.34,10.17 0 top
R18  130.18,16.52 0 top
R19  140.34,16.52 180 top
R20  130.18,19.06 0 top
R21  140.34,19.06 180 top
R22  130.18,31.76 0 top
R23  140.34,31.76 180 top
R24  130.18,34.3 0 top
R25  140.34,34.3 180 top
R26  16.51,27.95 0 top
R27  26.67,27.95 0 top
R28  36.83,27.95 180 top
R29  13.97,34.3 270 top
R30  19.05,40.65 180 top
R31  19.05,43.19 0 top
R32  19.05,48.27 180 top
R33  29.21,40.65 180 top
R34  29.21,43.19 180 top
R35  36.2,34.3 270 top
R36  99.69,30.49 180 top
R37  109.86,30.49 0 top
R38  99.69,43.19 180 top
R39  109.86,43.19 0 top
R40  13.34,55.89 270 top
R41  15.88,55.89 90 top
R42  27.3,55.89 90 top
R43  40.01,55.89 90 top
R44  51.44,55.89 90 top
R45  53.98,55.89 270 top
R46  61.59,55.89 270 top
R47  64.14,55.89 90 top
R48  75.56,55.89 90 top
R49  88.27,55.89 90 top
R50  99.69,55.89 90 top
R51  102.23,55.89 270 top
R52  109.86,55.89 270 top
R53  112.39,55.89 90 top
R54  124.46,55.89 90 top
R55  137.16,55.89 90 top
R56  149.86,55.89 90 top
R57  152.4,55.89 270 top
R58  15.24,63.51 180 top
R59  25.4,63.51 0 top
R60  38.1,63.51 180 top
R61  48.26,63.51 0 top
R62  60.96,63.51 180 top
R63  71.12,63.51 0 top
R64  88.9,63.51 180 top
R65  99.06,63.51 0 top
R66  111.76,63.51 180 top
R67  121.92,63.51 0 top
R68  134.62,63.51 180 top
R69  144.78,63.51 0 top
T1  15.24,68.59 0 top
T2  25.4,68.59 0 top
T3  38.1,68.59 0 top
T4  48.26,68.59 0 top
T5  60.96,68.59 0 top
T6  71.12,68.59 0 top
T7  88.9,68.59 0 top
T8  99.06,68.59 0 top
T9  111.76,68.59 0 top
T10  121.92,68.59 0 top
T11  134.62,68.59 0 top
T12  144.78,68.59 0 top
TP1  81.28,44.46 0 top
TP2  76.2,44.46 0 top
U/D  24.13,7.63 90 top
USB  10.16,17.79 270 top

### Tracks (layer width: path | path; a pad name or v marks a point on that pad's centre or on a via)
+5V
  Top 0.381: IC2.1 78.74,8.9 74.55,13.09 | C4.+ 74.55,13.09 | IC3.1 78.74,17.28 74.55,13.09 | C5.2 IC1.20 | R3.2 36.45,8.9 36.58,8.77 | 36.58,8.77 40.26,5.09 DIAG.A | R5.2 30.23,21.6 36.7,15.12 | 36.7,15.12 36.7,8.9 36.58,8.77 | 39.5,15.76 37.34,15.76 36.7,15.12 | 39.5,15.76 47.24,15.76 52.96,21.47 53.21,21.47 IC1.20 | C6.2 67.06,20.33 65.91,19.19 55.75,19.19 IC1.20 | DC1.6 134.37,41.92 143.38,32.9 149.1,32.9 149.73,32.27 149.73,24.01 C19.2 147.32,21.6 IC9.16 | IC7.4 104.78,43.57 104.01,44.33 94.74,44.33 90.68,40.27 90.68,34.17 90.3,33.79 | 90.3,33.79 C26.2 IC6.16 84.58,34.81 68.07,34.81 66.29,33.03 IC5.16 61.72,34.81 50.29,34.81 49.66,34.17 49.66,32.14 48.77,31.25 48.01,31.25 39.5,22.74 39.5,15.76 | C16.2 119.38,23.38 115.44,27.32 96.77,27.32 90.3,33.79
  Bottom 0.381: C4.+ C6.2 | IC4.4 25.65,38.11 27.43,39.89 28.45,39.89 29.34,39 29.34,22.11 R5.2 | IC8.4 104.78,21.98 105.54,22.74 118.24,22.74 C16.2 | DC1.6 133.6,41.92 131.19,44.33 105.54,44.33 104.78,43.57 IC7.4
+12V
  Top 0.381: IC10.8 29.84,52.97 33.15,56.27 33.15,64.02 33.4,64.27 | 33.4,64.27 34.16,65.03 36.45,65.03 38.1,66.69 T3.C 38.23,67.45 38.23,67.7 40.13,69.61 59.44,69.61 61.09,67.95 T5.C 60.96,67.57 62.99,69.61 77.72,69.61 C46.2 82.42,64.91 | T1.C 15.24,67.57 17.27,69.61 28.07,69.61 33.4,64.27 | IC11.8 78.11,52.97 82.42,57.29 82.42,64.91 | 82.42,64.91 82.55,65.03 87.25,65.03 88.9,66.69 T7.C 89.03,67.45 89.03,67.7 90.93,69.61 110.24,69.61 111.89,67.95 T9.C 111.76,67.57 113.79,69.61 127.13,69.61 131.7,65.03 133.48,65.03 | C31.2 147.07,39.38 144.53,41.92 DC1.2 144.02,42.05 143.64,42.05 134.75,50.94 134.11,50.94 129.54,55.51 | IC12.8 127,52.97 129.54,55.51 | 129.54,55.51 133.48,59.45 133.48,65.03 | 133.48,65.03 133.48,65.54 134.62,66.69 T11.C
  Bottom 0.381: POWER.1 1.78,31.25 1.78,33.03 | 1.78,33.03 1.78,37.35 POWER.5 | 1.78,33.03 5.08,33.03 11.56,39.51 11.56,43.7 14.99,47.13 15.75,47.13 20.57,51.95 20.57,53.86 21.08,54.37 27.56,54.37 IC10.8
-5V  (via drill 0.3)
  Top 0.381: IC4.11 25.65,30.49 30.86,35.7 37.97,35.7 41.15,38.87 46.48,38.87 IC5.7 C25.1 | 104.78,30.11 IC7.11 | 104.78,30.11 106.93,27.95 120.02,27.95 IC9.9 130.05,17.92 137.03,17.92 137.67,18.55 137.67,22.49 138.56,23.38 140.59,23.38 145.16,27.95 C20.1 | v102.87,29.35 104.01,29.35 104.78,30.11
  Bottom 0.381: IC6.7 70.87,40.65 69.6,39.38 | 69.6,39.38 65.02,34.81 60.45,34.81 59.56,33.92 59.56,31.89 58.93,31.25 50.29,31.25 49.4,32.14 49.4,39.51 IC5.7 | DC1.8 129.29,41.92 135.76,35.44 141.35,35.44 143.89,32.9 144.65,32.9 148.59,28.97 C20.1 | IC8.11 105.03,11.44 106.81,13.22 115.06,13.22 C15.1 119.51,9.03 126.87,9.03 127.51,9.66 127.51,20.46 IC9.9 | 69.6,39.38 75.06,33.92 75.06,31.89 76.96,29.98 94.74,29.98 95.38,29.35 v102.87,29.35
-12V
  Top 0.381: IC12.4 134.62,61.35 138.3,65.03 143.13,65.03 | 143.13,65.03 144.78,66.69 T12.C | C32.2 152.4,47.89 144.53,55.76 144.53,63.64 143.13,65.03 | T6.C 71.12,65.67 74.42,62.37 77.6,62.37 C45.2 | IC11.4 90.68,64.65 97.03,64.65 99.06,66.69 T8.C 98.68,66.05 102.36,62.37 110.11,62.37 112.39,64.65 119.89,64.65 121.92,66.69 T10.C | IC10.4 37.47,60.72 41.78,65.03 46.61,65.03 48.26,66.69 T4.C
  Bottom 0.381: T10.C 121.92,67.07 124.33,64.65 128.02,64.65 132.97,59.7 IC12.4 | C45.2 79.63,63.51 83.44,59.7 IC11.4 | POWER.3 10.92,41.41 10.92,51.45 17.02,57.54 17.02,57.79 21.59,62.37 22.1,62.37 25.4,65.67 | T2.C 25.4,65.67 | IC10.4 34.67,59.7 29.08,65.29 25.78,65.29 25.4,65.67 | T6.C 71.12,67.95 69.47,69.61 50.29,69.61 48.26,67.57 T4.C
AMPS1A
  Top 0.254: R37.2 113.67,31.76 113.6,31.82 | IC7.14 113.6,31.82 | P4.3 72.77,53.35 79.88,46.24 106.43,46.24 111.25,41.41 111.25,39.63 114.81,36.08 116.59,36.08 117.35,35.32 117.35,33.54 C29.2 115.7,31.89 113.67,31.89 113.6,31.82
AMPS1B  (via drill 0.3)
  Top 0.254: v101.09,37.6 101.09,36.97 IC7.8 95.95,31.82 | R36.2 95.89,31.76 95.95,31.82 | C27.2 95.38,32.39 95.95,31.82
  Bottom 0.254: P7.3 120.14,53.35 111.76,44.97 103.76,44.97 101.09,42.3 v101.09,37.6
AMPS3A
  Top 0.254: P5.3 96.9,53.35 103.5,46.75 110.11,46.75 R39.2 | IC7.1 112.39,42.05 113.54,43.19 R39.2 | C30.2 115.57,41.28 R39.2
AMPS3B
  Top 0.254: C28.2 93.98,41.28 R38.2
  Bottom 0.254: P6.3 106.05,53.35 R38.2 96.01,43.19 97.16,42.05 IC7.7
BXCF
  Top 0.254: IC8.14 111.12,11.44 | 111.12,11.44 IC8.13 | 111.12,11.44 C10.2
  Bottom 0.254: R14.1 117.73,6.36 116.59,7.5 112.27,7.5 C10.2
BZCF
  Top 0.254: 98.42,19.06 IC8.6 103.38,15.38 130.3,15.38 135.51,10.17 R17.1 | 98.42,19.06 IC8.7 | 98.42,19.06 C11.2
CS2
  Bottom 0.254: IC2.2 80.9,5.09 78.36,2.55 50.55,2.55 43.18,9.92 IC1.5
CS3
  Top 0.254: IC1.11 58.8,13.98 63.37,18.55 77.34,18.55 78.36,19.57 79.5,19.57 IC3.2
DACS1A
  Top 0.254: IC2.8 79.12,12.71 81.92,15.5 86.23,15.5 93.34,22.62 R6.1
DACS1B
  Bottom 0.254: R10.1 115.19,24.14 112.9,26.43 87.5,26.43 86.74,27.19 80.52,27.19 IC3.8
DACS3A
  Top 0.254: IC2.6 84.2,12.71 85.98,14.49 92.84,14.49 R7.1
DACS3B
  Bottom 0.254: R13.1 97.41,13.98 87.76,23.63 85.6,23.63 IC3.6
DIAG
  Top 0.254: IC1.6 R4.2
DOA_CLK
  Bottom 0.254: IC1.23 45.34,21.6 43.56,19.82 23.37,19.82 DOA.4
DOA_DAT
  Bottom 0.254: IC1.4 40.26,13.98 37.72,16.52 DOA.2
GND
  Top 0.508: C16.1 114.94,23.51 114.94,24.65 114.17,25.41 107.31,25.41 C13.2 C12.2 103.38,24.27 102.62,24.27 101.47,25.41 88.77,25.41 | C15.2 119.38,10.68 117.47,8.77 117.47,5.85 116.71,5.09 107.31,5.09 C9.2 C8.2 103.38,6.23 102.62,6.23 101.47,5.09 88.9,5.09 IC2.7 | C6.1 76.2,20.33 IC3.7 83.19,23.51 86.87,23.51 88.77,25.41 | 68.58,5.09 C2.1 | C3.2 68.58,5.09 | C5.1 IC1.19 | C4.- 74.3,15.25 72.9,16.65 71.88,16.65 70.99,15.76 70.99,9.66 71.25,9.41 71.25,7.76 68.58,5.09 | DC1.7 131.44,34.3 IC9.8 | DC1.1 C31.1 C32.1 153.67,46.36 153.67,55.13 154.94,56.4 C44.1 | C17.2 C18.2 C19.1 C20.2 C21.2 C22.2 | IC5.11 IC5.12 IC5.13 | C25.2 IC5.8 | 104.14,34.93 IC7.10 | 104.14,34.93 105.41,34.93 IC7.12 | 102.23,38.74 102.23,36.84 104.14,34.93 | 102.23,38.74 IC7.5 | IC7.3 105.41,38.74 102.23,38.74 | 70.48,42.55 IC6.8 | 70.48,42.55 71.75,42.55 IC6.6 | IC6.11 IC6.12 IC6.13 80.64,31.12 83.06,31.12 88.77,25.41 | P2.1 19.18,58.43 16.38,61.22 14.86,61.22 R40.1 C33.1 HYD-PRS-B.1 3.68,57.03 3.68,54.87 1.52,52.71 1.52,46.36 3.3,44.59 3.68,44.59 HYD-PRS-A.1 | 15.24,43.82 R31.1 | 15.24,43.82 C24.1 15.24,47.63 R32.2 | HYD-PRS-A.1 3.81,42.05 1.78,40.02 1.78,38.74 3.56,36.97 POWER.4 3.68,36.84 1.78,34.93 1.78,33.66 2.41,33.03 2.54,33.03 POWER.2 5.08,30.49 5.21,30.49 10.29,25.41 10.29,24.27 USB.S1 | HYD-PRS-A.1 13.21,44.46 13.72,43.95 15.11,43.95 15.24,43.82 | R27.2 IC4.12 DOA.5 21.46,24.01 10.29,24.01 USB.S1 | U/D.1 R2.1 | USB.S2 10.16,11.82 12.83,14.49 12.83,16.52 USB.4 12.83,16.77 10.16,19.44 USB.S1 | P3.1 48.13,58.43 48.39,58.68 50.42,58.68 50.93,58.18 52.45,58.18 R45.1 C36.1 C37.1 R46.1 | C46.1 C45.1 | C40.1 C41.1 R52.1
  Top 0.508: P4.1 68.71,57.29 68.71,52.97 70.36,51.32 70.36,42.68 70.48,42.55
  Bottom 0.508: C6.1 C4.- 75.06,15.12 78.87,15.12 IC2.7 | C1.1 49.53,5.85 50.8,7.12 | 50.8,7.12 IC1.8 55.88,19.06 IC1.19 | C2.1 60.58,5.09 60.2,4.71 53.21,4.71 50.8,7.12 | P7.1 146.56,58.43 146.81,58.68 148.84,58.68 149.35,58.18 150.88,58.18 R57.1 C44.1 | C31.1 152.4,41.16 151.13,39.89 C22.2 | DC1.7 131.7,41.92 133.48,40.14 144.91,40.14 DC1.1 | C25.2 46.99,42.55 48.9,42.55 IC5.6 IC5.11 | IC6.13 81.28,35.57 C26.1 90.17,36.2 99.06,36.2 IC7.10 | IC6.6 73.66,36.33 76.2,33.79 IC6.12 | IC5.13 61.59,38.74 66.67,38.74 IC6.8 | IC9.8 111.12,29.22 IC7.12 | U/D.1 24,6.36 21.59,8.77 DOA.1 21.46,14.11 15.37,14.11 12.95,16.52 USB.4 | R46.1 63.12,58.18 64.64,58.18 65.15,58.68 67.18,58.68 67.44,58.43 P4.1 69.98,58.56 71.75,58.56 78.74,65.54 C45.1 | P6.1 115.7,58.43 115.44,58.68 113.41,58.68 112.9,58.18 111.38,58.18 R52.1 | C40.1 R51.1 100.71,58.18 99.19,58.18 98.68,58.68 96.65,58.68 96.39,58.43 P5.1 88.9,60.97 85.85,60.97 83.31,63.51 C46.1 | P3.1 P2.1
LD2
  Bottom 0.254: IC2.5 85.98,12.71 84.2,10.93 64.01,10.93 IC1.12
LD3
  Top 0.254: IC1.17 61.34,21.6 66.93,27.19 84.58,27.19 IC3.5
M1XCF
  Top 0.254: IC8.1 111.12,19.06 | 111.12,19.06 IC8.2 | 111.12,19.06 C14.2
  Bottom 0.254: R16.1 124.08,10.17 115.19,19.06 IC8.1
M1YCF
  Top 0.254: IC8.9 98.42,11.44 | 98.42,11.44 IC8.8 | 98.42,11.44 C7.2
  Bottom 0.254: R15.1 135.51,6.36 134.37,5.22 99.57,5.22 C7.2
MCLR
  Top 0.254: IC1.1 R5.1 24.77,19.06 DOA.3
N$1
  Top 0.254: D1.A D2.C R32.1
  Bottom 0.254: IC4.6 20.32,39.63 22.48,41.79 24.26,41.79 | R33.2 24.26,41.79 | D1.A 25.4,44.71 24.26,43.57 24.26,41.79
N$2
  Top 0.254: R34.2 30.48,43.19 D1.C D2.A
N$3
  Top 0.254: C14.1 R9.1 116.2,19.06 R10.2
N$4
  Bottom 0.254: IC9.3 139.06,26.3 143,22.36 143,11.31 R17.2
N$5
  Top 0.254: IC8.3 106.05,20.33 R9.2 C13.1
N$6
  Top 0.254: IC4.9 R26.2 R27.1
N$7
  Top 0.254: R6.2 93.34,19.06 R8.1 C11.1
N$8
  Bottom 0.254: IC9.14 139.06,11.44 R15.2
N$9
  Top 0.254: C12.1 R8.2 103.38,21.6 102.23,20.46 IC8.5
N$10
  Top 0.254: IC4.13 R28.2 33.02,28.08 35.43,30.49 R35.2
N$11
  Top 0.254: C8.1 R11.2 103.38,8.9 102.23,10.04 IC8.10
N$12
  Top 0.254: R58.2 13.84,63.51 17.53,67.19 T1.B
N$13
  Top 0.254: R7.2 C7.1 R11.1
N$14
  Top 0.254: R29.2 15.62,30.49 17.4,32.27 21.08,32.27 IC4.10
N$15
  Top 0.254: R26.1 15.24,27.95 IC4.8 | IC5.1 61.72,42.43 60.58,42.43 58.8,40.65 IC5.3 54.1,44.97 45.34,44.97 44.96,44.59 32.89,44.59 27.94,39.63 IC4.3
  Bottom 0.254: IC4.3 27.56,38.11 21.72,32.27 19.56,32.27 IC4.8 | TP1.TP 81.28,42.43 | 81.28,42.43 IC6.3 | IC6.1 85.98,40.65 84.2,42.43 81.28,42.43 | IC5.1 66.42,40.65 68.2,42.43 81.28,42.43
N$16
  Top 0.254: P2.2 24.13,55.25 R42.1
N$17
  Top 0.254: R12.1 C10.1 R13.2
N$18
  Top 0.254: IC8.12 106.05,10.17 R12.2 C9.1
N$19
  Top 0.254: C23.2 13.97,39.38 R29.1 IC4.7 18.16,38.11 19.94,36.33 33.4,36.33 35.37,38.3 | R34.1 R33.1 35.37,38.3 | R35.1 35.56,38.11 35.37,38.3
N$20
  Top 0.254: R59.2 29.21,65.8 T2.B
N$21
  Top 0.254: P1.1 41.27,28.59 R28.1
N$22
  Top 0.254: C23.1 R30.2
N$23
  Top 0.254: IC10.5 R42.2
N$24
  Top 0.254: R60.2 36.7,63.51 40.39,67.19 T3.B
N$25
  Top 0.254: R61.2 52.07,65.8 T4.B
N$26
  Top 0.254: P6.2 121.28,55.25 R54.1
N$27
  Top 0.254: R62.2 59.56,63.51 63.25,67.19 T5.B
N$28
  Bottom 0.254: IC9.11 131.44,8.9 R14.2
N$29
  Top 0.254: R63.2 74.93,65.8 T6.B
N$30
  Top 0.381: R47.2 65.15,58.68 | 65.15,58.68 C38.2 | HYD-PRS-A.4 11.3,52.08 12.7,50.68 57.15,50.68 65.15,58.68
  Bottom 0.381: T5.E 58.67,65.16 61.47,62.37 | R47.2 61.47,62.37 | T6.E 66.42,67.32 61.47,62.37
N$31
  Top 0.381: C42.2 R53.2
  Bottom 0.381: T10.E 117.35,67.32 113.03,63 | 113.03,63 112.39,62.37 R53.2 | HYD-PRS-B.3 4.19,62.24 10.54,68.59 10.54,69.1 11.94,70.5 106.3,70.5 T9.E 109.6,67.19 109.6,66.43 113.03,63
N$32
  Bottom 0.254: IC9.6 131.44,23.76 132.84,22.36 132.84,11.31 R16.2
N$33
  Top 0.254: R67.2 125.73,65.8 T10.B
N$34
  Top 0.254: R66.2 110.36,63.51 114.05,67.19 T9.B
N$35
  Top 0.254: TP2.TP 76.2,42.43 | 76.2,42.43 IC6.5 | IC6.2 83.44,40.65 81.66,42.43 76.2,42.43 | IC5.2 59.18,38.87 55.5,38.87 53.72,40.65 IC5.5 52.96,40.65 49.78,37.48 P1.3 P1.2 34.29,30.49 IC4.14
  Bottom 0.254: TP2.TP 64.77,44.46 IC5.2
N$36
  Top 0.254: R64.2 87.5,63.51 91.19,67.19 T7.B
N$37
  Top 0.254: R65.2 102.87,65.8 T8.B
N$38
  Bottom 0.381: C35.2 R44.2 45.97,65.16 | 45.97,65.16 T4.E | HYD-PRS-B.2 4.19,59.7 11.43,66.94 11.43,68.72 12.32,69.61 33.53,69.61 T3.E 35.94,67.19 35.94,66.56 37.47,65.03 45.85,65.03 45.97,65.16
N$39
  Bottom 0.254: R68.2 133.22,63.51 136.91,67.19 T11.B
N$40
  Top 0.254: R69.2 148.59,65.8 T12.B
N$41
  Top 0.254: R43.2 IC10.3
N$42
  Top 0.381: R56.2 C43.2 | HYD-PRS-B.4 7.49,64.78 13.21,70.5 129.16,70.5 T11.E 132.08,67.83 133.86,69.61 137.54,69.61 139.83,67.32 T12.E
  Bottom 0.381: T12.E 142.49,66.69 149.48,59.7 R56.2
N$43
  Top 0.254: IC12.7 R67.1 R66.1
N$44
  Top 0.254: IC12.1 134.62,53.1 138.43,56.91 R68.1 R69.1
N$45
  Top 0.254: IC11.7 76.2,54.62 R63.1 R62.1
N$46
  Top 0.254: P3.2 43.81,55.89 R43.1
N$47
  Top 0.254: IC11.1 85.72,53.1 90.42,57.79 90.42,61.22 R64.1 R65.1
N$48
  Top 0.254: R58.1 R59.1 29.84,55.25 IC10.7
N$49
  Top 0.254: R21.2 R20.2 131.83,19.06 129.29,21.6 IC9.10
N$50
  Top 0.254: C18.1 R21.1
N$51
  Top 0.254: R18.2 R19.2 IC9.15
N$52
  Top 0.254: C17.1 R19.1
N$53
  Top 0.254: IC9.7 129.29,29.22 131.83,31.76 R22.2 R23.2
N$54
  Top 0.254: C21.1 R23.1
N$55
  Top 0.254: R24.2 R25.2 IC9.2
N$56
  Top 0.254: C22.1 R25.1
N$57
  Top 0.254: R37.1 107.31,30.49 IC7.13 111.76,34.93 C29.1
  Bottom 0.254: IC9.4 136.53,30.24 135.13,31.63 135.13,32.14 134.11,33.16 117.98,33.16 C29.1
N$58
  Top 0.254: R1.1 11.43,10.04 14.86,13.47 14.86,16.52 USB.1
N$59
  Top 0.254: IC7.2 109.47,40.65 106.93,43.19 R39.1 | IC9.13 136.14,21.6 130.3,27.44 125.98,27.44 116.2,37.22 C30.1
  Bottom 0.254: C30.1 111.76,38.74 IC7.2
N$60
  Top 0.254: R1.2 21.72,6.36 22.86,7.5 34.42,7.5 R2.2 38.23,3.69 58.93,3.69 63.5,8.27 IC1.13
N$61
  Top 0.254: IC1.10 55.88,10.17 Q1.1
  Bottom 0.254: Q1.1 63.5,6.36 C2.2
N$62
  Top 0.254: C28.1 97.79,38.74 IC7.6 102.23,43.19 R38.1
  Bottom 0.254: IC9.12 133.99,24.52 137.67,28.2 137.67,32.14 136.65,33.16 136.14,33.16 135.13,34.17 135.13,34.68 132.21,37.6 105.66,37.6 103.5,39.76 R38.1
N$63
  Top 0.254: R36.1 102.23,30.49 IC7.9
  Bottom 0.254: IC9.5 133.6,29.22 131.83,31 128.52,31 127.51,29.98 127.51,28.2 126.75,27.44 106.55,27.44 R36.1 | C27.1 97.79,34.93 IC7.9
N$64
  Top 0.254: P5.2 92.08,55.89 R49.1
N$65
  Top 0.254: R49.2 IC11.3
N$66
  Top 0.254: P4.2 72.39,55.25 R48.1
N$67
  Top 0.254: IC11.5 R48.2
N$68
  Top 0.254: IC10.1 37.47,53.1 41.91,57.54 R60.1 R61.1
N$69
  Top 0.254: IC12.5 R54.2
N$70
  Top 0.254: C33.2 R40.2 R41.1 C34.1
  Bottom 0.254: IC10.6 20.95,57.16 C34.1
N$71
  Top 0.254: P7.2 140.97,55.89 R55.1
N$72
  Top 0.254: C36.2 R45.2 R44.1 C35.1
  Bottom 0.254: C35.1 IC10.2
N$73
  Top 0.254: R46.2 R47.1 C38.1
  Bottom 0.254: R46.2 C37.2 | IC11.6 69.22,57.16 C38.1
N$74
  Top 0.254: R55.2 IC12.3
N$75
  Top 0.254: C40.2 R51.2 R50.1 C39.1
  Bottom 0.254: C39.1 IC11.2
N$77
  Top 0.254: C41.2 R52.2 R53.1 C42.1
  Bottom 0.254: IC12.6 117.47,57.16 C42.1
N$79
  Top 0.254: R57.2 R56.1 C43.1
  Bottom 0.254: R57.2 C44.2 | C43.1 IC12.2
N$84
  Top 0.254: 53.34,6.36 50.8,6.36 C1.2 | 53.34,6.36 Q1.2 | 53.34,6.36 IC1.9
N$85
  Top 0.254: IC4.5 R30.1 R31.2 20.32,45.73 C24.2
N$88
  Top 0.254: R4.1 39.37,8.9 DIAG.K
N$96
  Top 0.254: IC1.14 66.04,12.71 C3.1
N$99  (via drill 0.38)
  Top 0.381: R50.2 C39.2 | HYD-PRS-A.3 14.61,49.54 14.73,49.67 v69.22,49.67
  Bottom 0.381: T7.E 86.61,67.95 88.27,69.61 94.49,69.61 T8.E 96.9,67.19 96.9,62.49 R50.2 | v69.22,49.67 94.23,49.67 98.55,53.98 98.55,55.76 C39.2
N$106
  Top 0.381: R41.2 C34.2
  Bottom 0.381: HYD-PRS-A.2 5.21,47 15.88,57.67 R41.2 12.95,62.62 12.95,65.03 | 12.95,65.03 T1.E | T2.E 20.45,67.32 18.16,65.03 12.95,65.03
S1A
  Bottom 0.254: R24.1 118.36,34.3 115.82,36.84 100.2,36.84 99.44,37.6 91.57,37.6 82.93,46.24 61.47,46.24 IC5.4
S1B
  Bottom 0.254: R22.1 118.36,31.76 116.33,33.79 113.79,33.79 111.25,36.33 99.95,36.33 99.19,37.09 82.3,37.09 IC6.4
S3A
  Bottom 0.254: R18.1 125.98,16.52 115.57,26.93 87.76,26.93 85.34,29.35 64.64,29.35 IC5.15
S3B
  Top 0.254: R20.1 120.9,19.06 119.51,20.46 119,20.46 117.35,22.11 117.35,24.52 115.19,26.68 90.17,26.68 IC6.15
SINROT
  Top 0.254: IC4.2 IC4.1
  Bottom 0.254: P2.3 22.48,53.35 30.42,45.41 | 30.42,45.41 30.48,45.35 IC4.2 | P3.3 42.8,53.35 36.32,46.87 31.88,46.87 30.42,45.41
SPI_CLK
  Top 0.254: IC2.3 83.82,5.47 77.6,11.69 77.6,13.73 79.88,16.01 82.04,16.01 IC3.3
  Bottom 0.254: IC1.22 48.26,21.98 52.2,25.92 75.69,25.92 IC3.3
SPI_DAT
  Bottom 0.254: IC2.4 86.36,10.55 87.5,11.69 87.5,16.65 IC3.4 86.36,17.66 84.71,16.01 80.9,16.01 80.14,16.77 80.14,18.55 77.22,21.47 72.01,21.47 70.36,19.82 60.58,19.82 58.8,21.6 IC1.18
SYNAS1POL
  Top 0.254: IC1.27 35.81,21.6 45.72,31.51 IC5.9
SYNAS3POL
  Top 0.254: IC1.26 38.1,22.87 IC5.10
SYNBS1POL
  Top 0.254: IC1.25 41.02,21.6 50.67,31.25 66.8,31.25 IC6.9
SYNBS3POL
  Top 0.254: IC1.24 43.56,21.6 52.7,30.74 68.83,30.74 IC6.10
USB_DM  (via drill 0.3)
  Top 0.254: IC1.15 65.66,21.6 63.88,19.82 60.58,19.82 59.56,20.84 59.56,22.62 56.26,25.92 v48.9,25.92
  Bottom 0.254: v48.9,25.92 35.18,25.92 30.99,21.73 30.99,21.22 30.23,20.46 25.15,20.46 22.86,22.74 18.67,22.74 14.99,19.06 USB.2
USB_DP
  Bottom 0.254: IC1.16 63.12,21.6 61.34,23.38 50.42,23.38 49.4,22.36 49.4,20.58 46.74,17.92 13.97,17.92 12.95,18.93 USB.3
USBDOA
  Top 0.254: U/D.2 R3.1 30.1,8.9 35.18,13.98 IC1.2

### Text on the board
tNames: JLCJLCJLCJLC | S1 | S3 | RT | CM | S1 | S3 | RT | F-16 | HYDRAULIC PRESSURE A & B | V2.0 | TMH 1205D | CM | SYM | +12V | GND | -12V | GND | +12V | GND | CLK | RST | DAT | GND